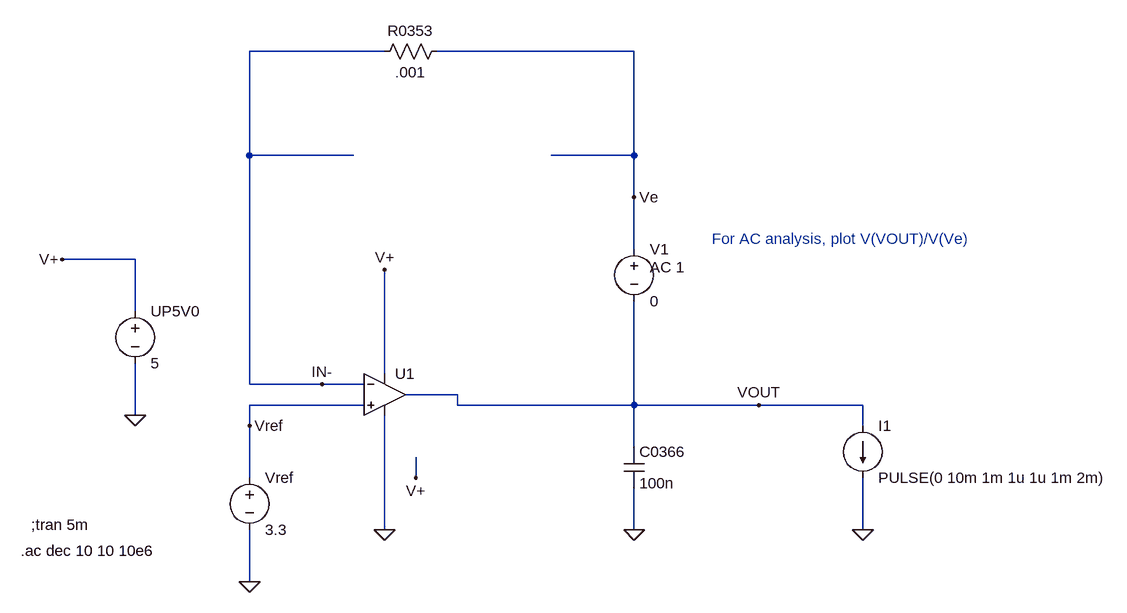
[diagram p0: schematic REFBuffer_Univ_2.asc]
REFBuffer_Univ_2.asc, the LTspice schematic file:
Version 4
SHEET 1 1260 680
WIRE 144 -368 -64 -368
WIRE 528 -368 224 -368
WIRE -64 -208 -64 -368
WIRE 96 -208 -64 -208
WIRE 528 -208 528 -368
WIRE 528 -208 400 -208
WIRE 528 -144 528 -208
WIRE 528 -64 528 -144
WIRE -240 -48 -352 -48
WIRE -240 32 -240 -48
WIRE 144 128 144 -32
WIRE -64 144 -64 -208
WIRE 48 144 -64 144
WIRE 112 144 48 144
WIRE 256 160 176 160
WIRE 112 176 -64 176
WIRE 256 176 256 160
WIRE 528 176 528 16
WIRE 528 176 256 176
WIRE 720 176 528 176
WIRE 880 176 720 176
WIRE -240 192 -240 112
WIRE -64 208 -64 176
WIRE 880 208 880 176
WIRE 528 240 528 176
WIRE -64 288 -64 208
WIRE 192 288 192 256
WIRE 144 368 144 192
WIRE 528 368 528 304
WIRE 880 368 880 288
WIRE -64 448 -64 368
FLAG -240 192 0
FLAG -352 -48 V+
FLAG 144 368 0
FLAG 144 -32 V+
FLAG 192 288 V+
FLAG 528 368 0
FLAG -64 448 0
FLAG -64 208 Vref
FLAG 720 176 VOUT
FLAG 48 144 IN-
FLAG 880 368 0
FLAG 528 -144 Ve
SYMBOL voltage -240 16 R0
SYMATTR InstName UP5V0
SYMATTR Value 5
SYMBOL cap 512 240 R0
SYMATTR InstName C0366
SYMATTR Value 100n
SYMBOL voltage -64 272 R0
WINDOW 123 0 0 Left 0
WINDOW 39 0 0 Left 0
SYMATTR InstName Vref
SYMATTR Value 3.3
SYMBOL res 240 -384 R90
WINDOW 0 0 56 VBottom 2
WINDOW 3 32 56 VTop 2
SYMATTR InstName R0353
SYMATTR Value .001
SYMBOL voltage 528 -80 R0
WINDOW 123 24 44 Left 2
WINDOW 39 0 0 Left 0
SYMATTR Value2 AC 1
SYMATTR InstName V1
SYMATTR Value 0
SYMBOL current 880 208 R0
WINDOW 123 0 0 Left 0
WINDOW 39 0 0 Left 0
SYMATTR InstName I1
SYMATTR Value PULSE(0 10m 1m 1u 1u 1m 2m)
SYMBOL Opamps\\UniversalOpamp2 144 160 R0
SYMATTR InstName U1
SYMATTR Value2 Avol=1Meg GBW=20Meg Slew=10Meg
SYMATTR SpiceLine ilimit=65m rail=0 Vos=0 phimargin=45
SYMATTR SpiceLine2 en=7n enk=0 in=0.6f ink=0 Rin=500Meg
TEXT -400 360 Left 2 !;tran 5m
TEXT -416 400 Left 2 !.ac dec 10 10 10e6
TEXT 648 -80 Left 2 ;For AC analysis, plot V(VOUT)/V(Ve)

The netlist it stands for:
* REFBuffer_Univ_2.asc
V§UP5V0 V+ 0 5
C0366 VOUT 0 100n
Vref Vref 0 3.3
R0353 Ve IN- .001
V1 Ve VOUT 0 AC 1
I1 VOUT 0 PULSE(0 10m 1m 1u 1u 1m 2m)
XU1 Vref IN- V+ 0 VOUT level.2 Avol=1Meg GBW=20Meg Slew=10Meg ilimit=65m rail=0 Vos=0 phimargin=45 en=7n enk=0 in=0.6f ink=0 Rin=500Meg  ; pins IN+ IN- V+ V- OUT
;tran 5m
.ac dec 10 10 10e6
* For AC analysis, plot V(VOUT)/V(Ve)
.lib UniversalOpamps2.sub
.backanno
.end